# Altium project PSU24_for_FAN.PrjPcb
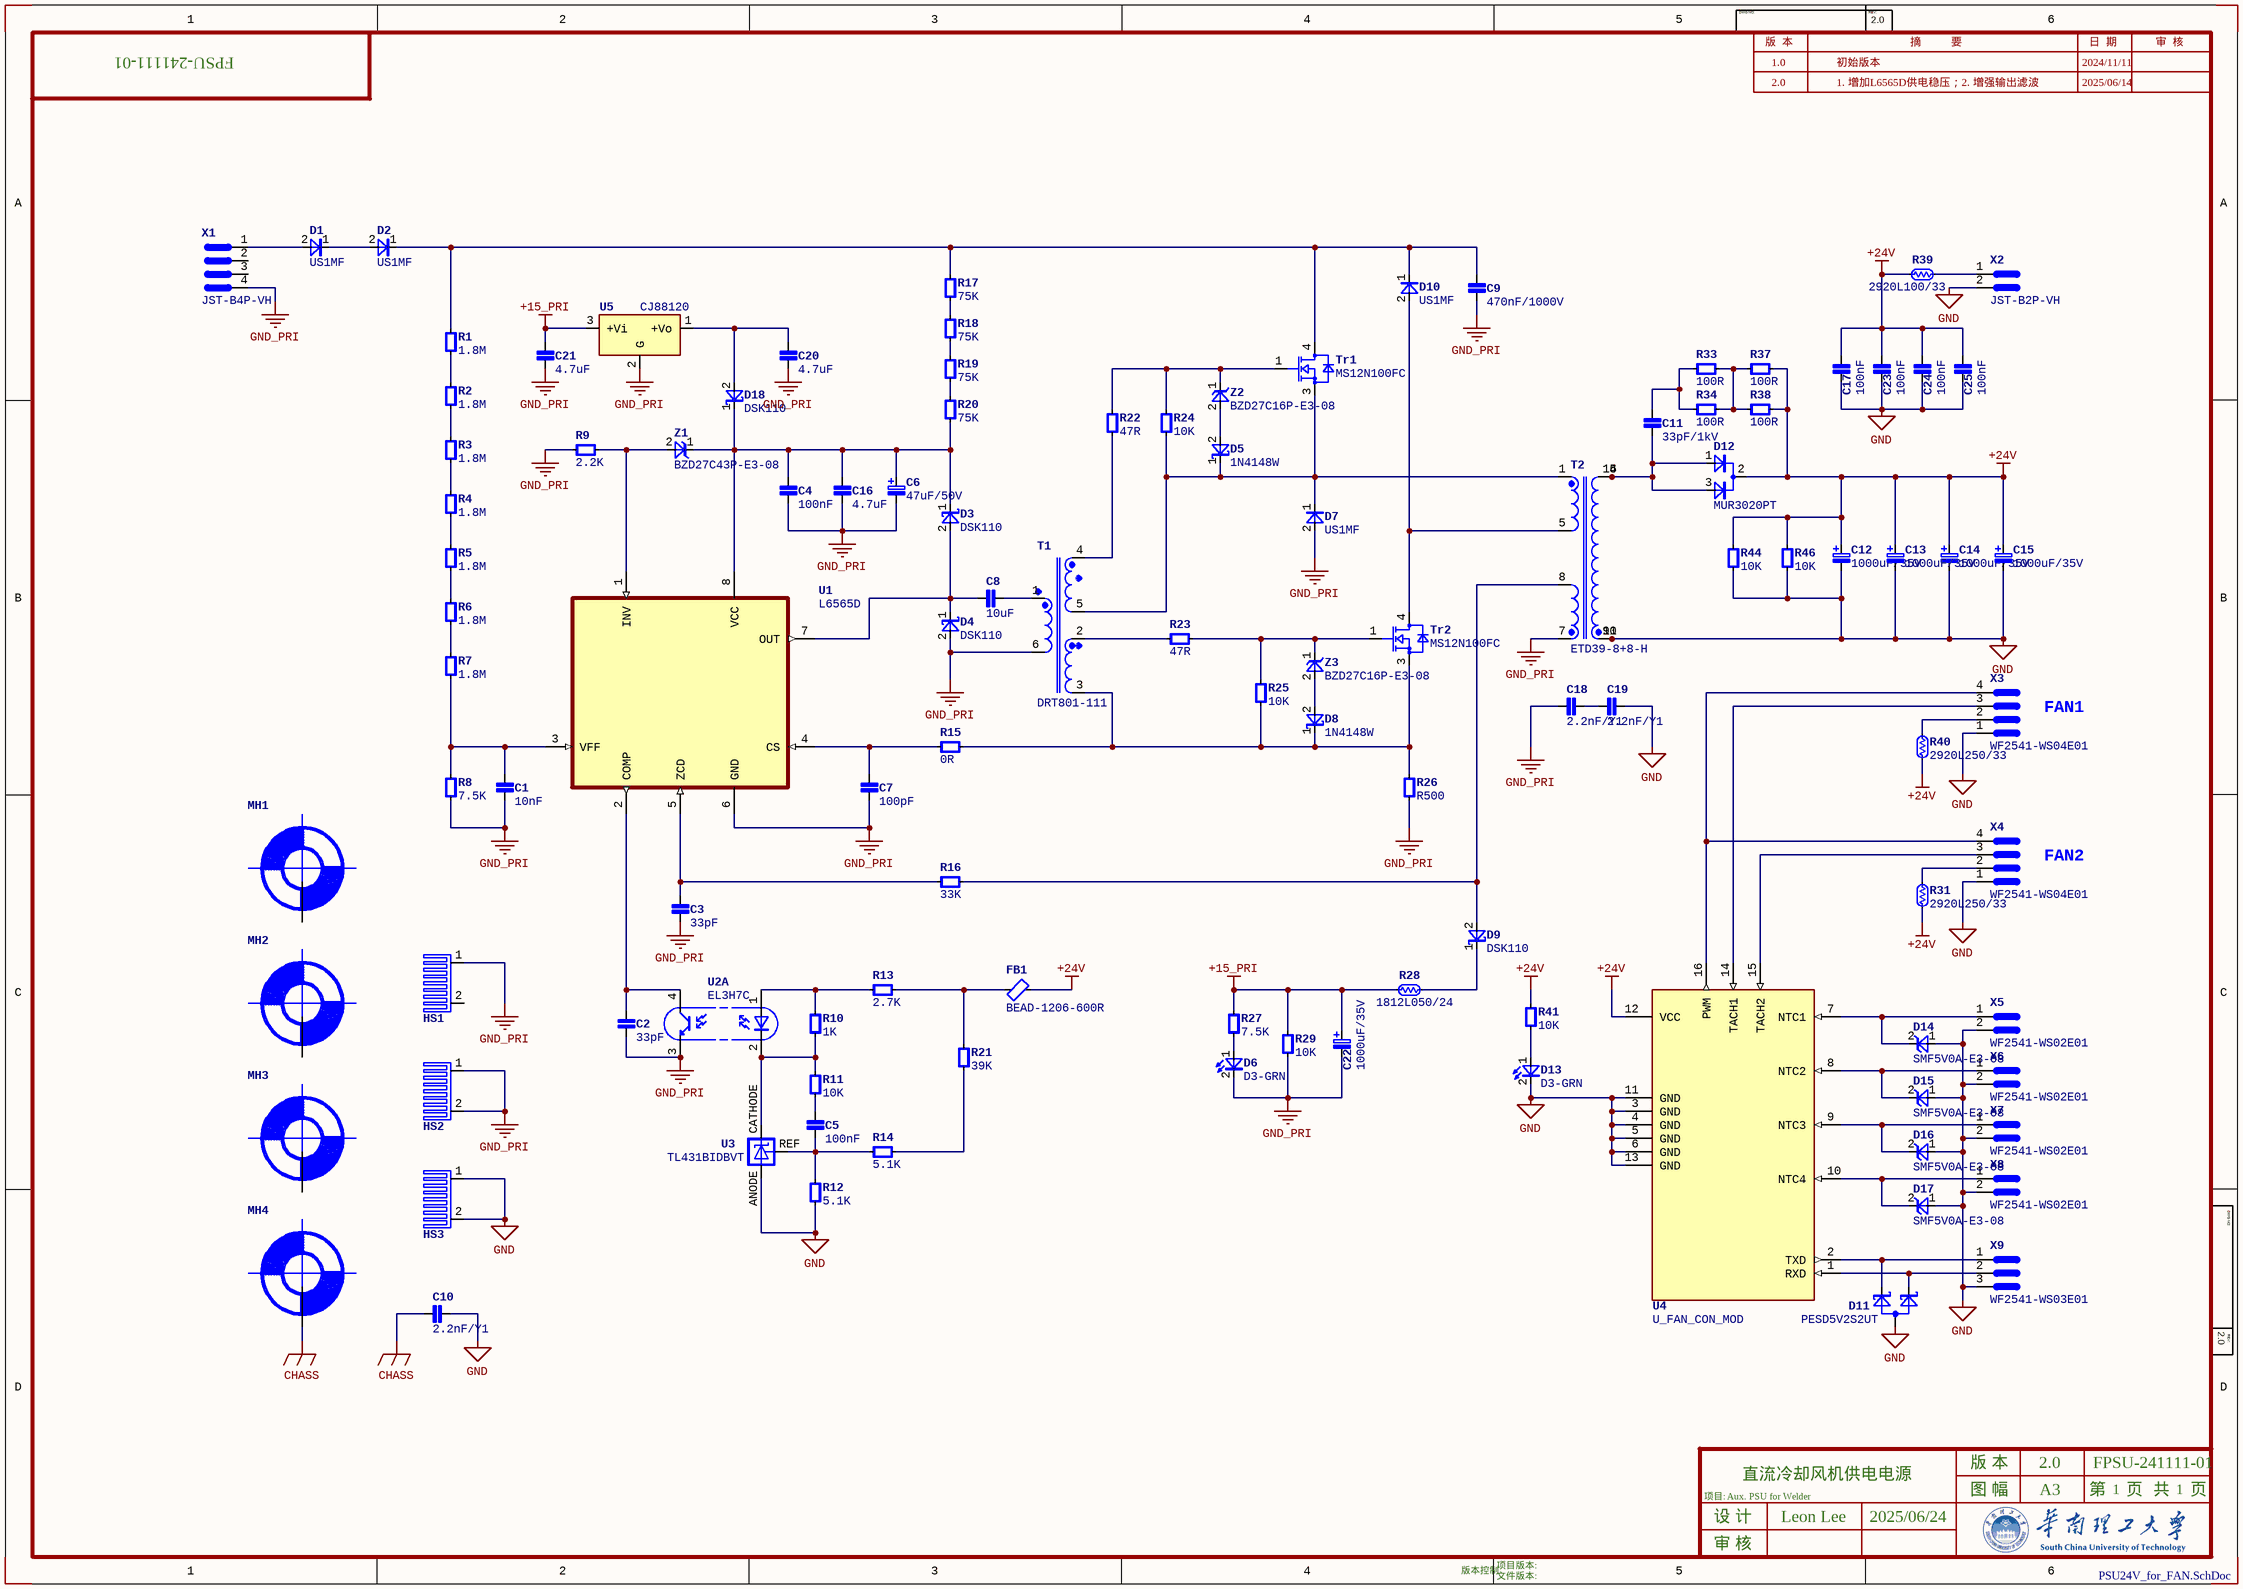
[diagram p0: PSU24V_for_FAN.SchDoc]
1 sheet, 111 parts. Net scope: global (net labels, ports and power ports of the same name join across sheets).
Board file: PSU24_for_FAN.PcbDoc

## Sheet PSU24V_for_FAN.SchDoc: 直流冷却风机供电电源
size 419 x 297 mm; Date: 2025/06/24; Author: Leon Lee; CompanyName: 华南理工大学; Organization: 华南理工大学; Address1: 五山路381号; Address2: 天河区，广州市; Address3: 广东省; DocumentNumber: FPSU-241111-01; Revision: 2.0; SheetNumber: 1; SheetTotal: 1; Project: Aux. PSU for Welder

### Parts
C1  10nF  [CAPC1206N]
C2  33pF  [CAPC1206N]
C3  33pF  [CAPC1206N]
C4  100nF  [CAPC1206N]
C5  100nF  [CAPC1206N]
C6  47uF/50V  [RB2.5M/D6.3]
C7  100pF  [CAPC1206N]
C8  10uF  [CAPC1206N]
C9  470nF/1000V  [PCM27.5-W17]
C10  2.2nF/Y1  [CAPRD10-10x5]
C11  33pF/1kV  [CAPC1206N]
C12  1000uF/35V  [RB5M/D10]
C13  1000uF/35V  [RB5M/D10]
C14  1000uF/35V  [RB5M/D10]
C15  1000uF/35V  [RB5M/D10]
C16  4.7uF  [CAPC1206N]
C17  100nF  [CAPC1206N]
C18  2.2nF/Y1  [CAPRD10-10x5]
C19  2.2nF/Y1  [CAPRD10-10x5]
C20  4.7uF  [CAPC1206N]
C21  4.7uF  [CAPC1206N]
C22  1000uF/35V  [RB5M/D10]
C23  100nF  [CAPC1206N]
C24  100nF  [CAPC1206N]
C25  100nF  [CAPC1206N]
D1  US1MF  [SMAF]
D2  US1MF  [SMAF]
D3  DSK110  [SMF-N-1K2A]
D4  DSK110  [SMF-N-1K2A]
D5  1N4148W  [SOD-123 - 1K2A]
D6  D3-GRN  [LED-D3]
D7  US1MF  [SMAF]
D8  1N4148W  [SOD-123 - 1K2A]
D9  DSK110  [SMF-N-1K2A]
D10  US1MF  [SMAF]
D11  PESD5V2S2UT  [SOT-23_N]
D12  MUR3020PT  [TO-247-3_Vertical]
D13  D3-GRN  [LED-D3]
D14  SMF5V0A-E3-08  [SMF-N]
D15  SMF5V0A-E3-08  [SMF-N]
D16  SMF5V0A-E3-08  [SMF-N]
D17  SMF5V0A-E3-08  [SMF-N]
D18  DSK110  [SMF-N-1K2A]
FB1  BEAD-1206-600R  [RESC1206N]
HS1  HS-TO247-42x25x40  [HEATSINK_TO220_Vertical_42x25x38]  (value not drawn)
HS2  HS-TO247-42x25x40  [HEATSINK_TO220_Vertical_42x25x38]  (value not drawn)
HS3  HS-TO247-42x25x40  [HEATSINK_TO220_Vertical_42x25x38]  (value not drawn)
MH1  MH1  [MH-D32-4x4]  (value not drawn)  (no BOM)
MH2  MH1  [MH-D32-4x4]  (value not drawn)  (no BOM)
MH3  MH1  [MH-D32-4x4]  (value not drawn)  (no BOM)
MH4  MH1  [MH-D32-4x4-PE]  (value not drawn)  (no BOM)
R1  1.8M  [RESC1206N]
R2  1.8M  [RESC1206N]
R3  1.8M  [RESC1206N]
R4  1.8M  [RESC1206N]
R5  1.8M  [RESC1206N]
R6  1.8M  [RESC1206N]
R7  1.8M  [RESC1206N]
R8  7.5K  [RESC1206N]
R9  2.2K  [RESC1206N]
R10  1K  [RESC1206N]
R11  10K  [RESC1206N]
R12  5.1K  [RESC1206N]
R13  2.7K  [RESC1206N]
R14  5.1K  [RESC1206N]
R15  0R  [RESC1206N]
R16  33K  [RESC1206N]
R17  75K  [RESC1206N]
R18  75K  [RESC1206N]
R19  75K  [RESC1206N]
R20  75K  [RESC1206N]
R21  39K  [RESC1206N]
R22  47R  [RESC1206N]
R23  47R  [RESC1206N]
R24  10K  [RESC1206N]
R25  10K  [RESC1206N]
R26  R500  [RESC1225N]
R27  7.5K  [RESC1206N]
R28  1812L050/24  [PTCC1812N]
R29  10K  [RESC1206N]
R31  2920L250/33  [PTC2920N]
R33  100R  [RESC1206N]
R34  100R  [RESC1206N]
R37  100R  [RESC1206N]
R38  100R  [RESC1206N]
R39  2920L100/33  [PTC2920N]
R40  2920L250/33  [PTC2920N]
R41  10K  [RESC1206N]
R44  10K  [RESC1206N]
R46  10K  [RESC1206N]
T1  DRT801-111  [TRANS-DRT801-1+1+1]
T2  ETD39-8+8-H  [ETD39-8+8pins]
Tr1  MS12N100FC  [TO-247-3_Vertical]
Tr2  MS12N100FC  [TO-247-3_Vertical]
U1  L6565D  [SOIC-8N]
U2  EL3H7C  [FP-EL3H7-G-MFG]  (parts A,B of 2)
U3  TL431BIDBVT  [SOT23-5_N]
U4  U_FAN_CON_MOD  [U_FAN_CON]
U5  CJ88120  [FP-SOT89-MFG]
X1  JST-B4P-VH  [B4P-VH]
X2  JST-B2P-VH  [B2P-VH]
X3  WF2541-WS04E01  [WF2541-WSXX01-4PIN]
X4  WF2541-WS04E01  [WF2541-WSXX01-4PIN]
X5  WF2541-WS02E01  [WF2541-WSXX01-2PIN]
X6  WF2541-WS02E01  [WF2541-WSXX01-2PIN]
X7  WF2541-WS02E01  [WF2541-WSXX01-2PIN]
X8  WF2541-WS02E01  [WF2541-WSXX01-2PIN]
X9  WF2541-WS03E01  [WF2541-WSXX01-3PIN]
Z1  BZD27C43P-E3-08  [SOD-123 - 1K2A]
Z2  BZD27C16P-E3-08  [SOD-123 - 1K2A]
Z3  BZD27C16P-E3-08  [SOD-123 - 1K2A]

### Nets
+15_PRI: C21.1 C22.1 R27.2 R28.1 R29.2 U5.3(+Vi)
+24V: C12.1 C13.1 C14.1 C15.1 C17.1 C23.1 C24.1 C25.1 D12.2(K) FB1.2 R31.1 R37.1 R38.1 R39.1 R40.1 R41.2 R44.1 R46.1 U4.12(VCC)
CHASS: C10.2 MH4.0
GND: C10.1 C12.2 C13.2 C14.2 C15.2 C17.2 C19.1 C23.2 C24.2 C25.2 D11.3(A) D13.2(K) D14.1(A) D15.1(A) D16.1(A) D17.1(A) HS3.1 HS3.2 R12.1 R44.2 R46.2 T2.9 T2.10 T2.11 U3.ANODE U4.3(GND) U4.4(GND) U4.5(GND) U4.6(GND) U4.11(GND) U4.13(GND) X2.2 X3.1 X4.1 X5.2 X6.2 X7.2 X8.2 X9.3
GND_PRI: C1.2 C2.2 C3.2 C4.2 C6.2 C7.2 C9.2 C16.2 C18.2 C20.2 C21.2 C22.2 D4.2(A) D6.2(K) D7.2(A) HS1.1 HS2.1 HS2.2 R8.2 R9.2 R26.2 R29.1 T1.6 T2.7 U1.6(GND) U2.3(E) U5.2(G) X1.4
NetC1_1: C1.1 R7.2 R8.1 U1.3(VFF)
NetC2_1: C2.1 U1.2(COMP) U2.4(C)
NetC3_1: C3.1 R16.1 U1.5(ZCD)
NetC4_1: C4.1 C6.1 C16.1 D3.1(K) D18.1(K) R20.1 U1.8(VCC) Z1.1(K)
NetC5_1: C5.1 R11.1
NetC5_2: C5.2 R12.2 R14.1 U3.REF
NetC7_1: C7.1 R15.1 U1.4(CS)
NetC8_1: C8.1 D3.2(A) D4.1(K) U1.7(OUT)
NetC8_2: C8.2 T1.1
NetC9_1: C9.1 D2.1(K) D10.1(K) R1.1 R17.2 Tr1.4(D)
NetC11_1: C11.1 R33.2 R34.2
NetC11_2: C11.2 D12.1(A) D12.3(A) T2.14 T2.15 T2.16
NetC18_1: C18.1 C19.2
NetC20_1: C20.1 D18.2(A) U5.1(+Vo)
NetD1_1: D1.1(K) D2.2(A)
NetD1_2: D1.2(A) X1.1
NetD5_1: D5.1(K) D7.1(K) R24.1 T1.5 T2.1 Tr1.3(S)
NetD5_2: D5.2(A) Z2.2(A)
NetD6_1: D6.1(A) R27.1
NetD8_1: D8.1(K) R15.2 R25.1 R26.1 T1.3 Tr2.3(S)
NetD8_2: D8.2(A) Z3.2(A)
NetD9_1: D9.1(K) R28.2
NetD9_2: D9.2(A) R16.2 T2.8
NetD10_2: D10.2(A) T2.5 Tr2.4(D)
NetD11_1: D11.1(K1) U4.2(TXD) X9.1
NetD11_2: D11.2(K2) U4.1(RXD) X9.2
NetD13_1: D13.1(A) R41.1
NetD14_2: D14.2(K) U4.7(NTC1) X5.1
NetD15_2: D15.2(K) U4.8(NTC2) X6.1
NetD16_2: D16.2(K) U4.9(NTC3) X7.1
NetD17_2: D17.2(K) U4.10(NTC4) X8.1
NetFB1_1: FB1.1 R13.2 R21.2
NetR1_2: R1.2 R2.1
NetR2_2: R2.2 R3.1
NetR3_2: R3.2 R4.1
NetR4_2: R4.2 R5.1
NetR5_2: R5.2 R6.1
NetR6_2: R6.2 R7.1
NetR9_1: R9.1 U1.1(INV) Z1.2(A)
NetR10_1: R10.1 R11.2 U2.2(K) U3.CATHODE
NetR10_2: R10.2 R13.1 U2.1(A)
NetR14_2: R14.2 R21.1
NetR17_1: R17.1 R18.2
NetR18_1: R18.1 R19.2
NetR19_1: R19.1 R20.2
NetR22_1: R22.1 T1.4
NetR22_2: R22.2 R24.2 Tr1.1(G) Z2.1(K)
NetR23_1: R23.1 R25.2 Tr2.1(G) Z3.1(K)
NetR23_2: R23.2 T1.2
NetR31_2: R31.2 X4.2
NetR33_1: R33.1 R34.1 R37.2 R38.2
NetR39_2: R39.2 X2.1
NetR40_2: R40.2 X3.2
NetU4_14: U4.14(TACH1) X3.3
NetU4_15: U4.15(TACH2) X4.3
NetU4_16: U4.16(PWM) X3.4 X4.4

Not connected (* = marked no-connect by the designer): HS1 2; MH1 0; MH2 0; MH3 0; X1 2 3

### Notes on the sheet
- 1.0
- 初始版本
- 2024/11/11
- 2.0
- 1. 增加L6565D供电稳压；2. 增强输出滤波
- 2025/06/14
- (near X3) FAN1
- (near X4) FAN2
- DWG NO:
- 版  本
- REV:
- 摘          要
- 日  期
- 审  核
- 版 本
- 项目:
- 设 计
- 审 核
- 图 幅
- A3
- 第
- 页
- 共
- 版本控制
- 项目版本:
- 文件版本:

### Library data of the parts
C1-C5 C7 C16 C17 C20 C21 C23-C25 = CAPACITOR(S): 名称: 贴片电容; 代号: C; 型号: X7R-50V-1206-10%; 备注: X7R/X5R系列
C6 = CAPACITOR POL(S): 名称: 电解电容; 代号: C; 型号: RUBYCON-YK; 备注: Ø6.3x12mm，脚距2.5mm
C8 = CAPACITOR(S): 名称: 贴片电容; 代号: C; 型号: X7R-25V-1206-10%; 备注: X7R/X5R系列
C9 = CAPACITOR(S): 名称: 金属化聚丙烯薄膜电容; 代号: C; 型号: CBB-1000V-10%; 备注: 脚距27.5mm，厚17mm
C10 C18 C19 = CAPACITOR(S): 名称: 交流陶瓷安规电容; 代号: C; 型号: Y1-400Vac-10%; 备注: 10mm脚距
C11 = CAPACITOR(S): 名称: 贴片电容; 代号: C; 型号: CC1206JKNPOCBN330; 备注: NPO系列，1kV，5%
C12-C15 C22 = CAPACITOR POL(S): 名称: 电解电容; 代号: C; 型号: RUBYCON-YK; 备注: Ø10x20mm，脚距5mm
D1 D2 D7 D10 = DIODE(S): 二极管; 代号: D; 名称: 贴片二极管; 型号: 1A/1000V/快恢复; 备注: SMAF封装
D3 D4 D9 D18 = DIODE SCHOTTKY(S): 肖特基二极管; 名称: 贴片肖特基二极管; 代号: D; 型号: 1A/100A/SMF; 备注: SMF或SOD-123FL封装
D5 D8 = DIODE SCHOTTKY(S): 肖特基二极管; 名称: 贴片二极管; 代号: D; 型号: 1N4148W/SOD123; 备注: SOD-123封装
D6 D13 = LED(S): 发光二极管; pin to pad: 1>A 2>K; 代号: DLED; 型号: Ø3-绿色; 备注: 雾状透镜; 名称: 发光二极管
D11 = DIODE BAS40-06: Schottky barrier (double) diodes; 名称: 贴片ESD二极管; 代号: DESD; 型号: 5V，双路，单向; 备注: SOT23封装，单向TVS
D12 = DIODE MUR1620CT: 快恢复二极管; 代号: D; 型号: 200V/30A/TO-247; 备注: TO-247，共阴极; 名称: 快恢复二极管
D14-D17 = DIODE ZENER(S): 齐纳二极管; 名称: 贴片ESD二极管; 代号: DESD; 型号: SMF-5V-单向; 备注: Vishay, SMF-TVS
FB1 = FerriteBead1: 磁珠电感; 代号: LB; 名称: 贴片磁珠电感; 型号: BEAD-1206-600R
HS1-HS3 = HEATSINK_2PINS: 散热器, 2脚; 代号: HS; 名称: 铝散热器; 备注: 表面发黑; 型号: TO247-42x25x40
MH1-MH4 = MH1: 安装孔
R1-R9 R15-R20 R22-R26 R33 R34 R37 R38 R44 R46 = RESISTOR(S): 电阻; 代号: R; 名称: 贴片电阻; 型号: CR1206-1%; 备注: 风华或国巨
R10-R14 R21 R27 R29 R41 = RESISTOR(S): 名称: 贴片电阻; 代号: R; 型号: CR1206-1%; 备注: 风华或国巨
R28 = RESISTOR(S) NL: None Liner Resistor; 代号: RT; 名称: 贴片可恢复保险; 型号: 0.5A/24V/1812
R31 R40 = RESISTOR(S) NL: None Liner Resistor; 代号: RT; 名称: 贴片可恢复保险; 型号: 2.5A/33V/2920
R39 = RESISTOR(S) NL: None Liner Resistor; 代号: RT; 名称: 贴片可恢复保险; 型号: 1A/33V/2920
T1 = Transformer DRT801-111: IGBT驱动变压器, DRT801/111, 12.5x16.6mm; 代号: T; 名称: 脉冲变压器; 型号: DRT801-1111; 备注: 北京耀华德昌
T2 = TRANSFORM-Flyback_PSU_for_FAN: 反激变压器，初级2组，次级2组，通用焊接电源风扇供电，24V+24V; 代号: T; 名称: 变压器; 型号: ETD39-8+8卧式; 备注: 按图纸加工
Tr1 Tr2 = MOSFET - N-CH: MOSFET N-CH D-PAK/TO252; pin to pad: 4>2; Manufacturer: Fairchild; Part Number: SUD40N08-16-E3; 代号: Tr; 名称: 场效应管; 型号: 1000V/12A/TO-247
U1 = L6565D: ST, QUASI-RESONANT SMPS CONTROLLER; 代号: U; 名称: 贴片集成电路; 型号: L6565D; 备注: ST
U2 = Optical-Couple: 代号: IC; 名称: 贴片集成电路; 备注: Everlight(亿光); 型号: EL3H7C
U3 = TL431CLP: 可调基准电压集成; pin to pad: ANODE>5 CATHODE>3 REF>4; 代号: IC; 名称: 贴片集成电路; 备注: SOT23-5封装; 型号: TL431BIDBVT
U4 = U_FAN_CON_MOD: 直流风扇转速控制模块; 代号: U; 名称: 专用厚膜集成电路; 备注: 定制
U5 = 78LXX: pin to pad: 1>3 2>1 3>2; 代号: U; 名称: 贴片集成电路; 备注: SOT89封装，12V@150mA; 型号: CJ88120
X1 = 4PIN-PCB-Connector: 线路板接插件; 代号: X; 名称: 接插件; 备注: JST; 型号: B4P-VH
X2 = 2PIN-PCB-Connector: 线路板接插件; 代号: X; 名称: 接插件; 备注: JST; 型号: B2P-VH
X3 X4 = 4PIN-PCB-Connector: 线路板接插件; 代号: X; 名称: 接插件; 备注: 2.54间距，4pin; 型号: WF2541-WS04E01
X5-X8 = 2PIN-PCB-Connector: 线路板接插件; 代号: X; 名称: 接插件; 备注: 2.54间距，2pin; 型号: WF2541-WS02E01
X9 = 3PIN-PCB-Connector: 线路板接插件; 代号: X; 名称: 接插件; 备注: 2.54间距，3pin; 型号: WF2541-WS03E01
Z1 = DIODE ZENER(S): 齐纳二极管; 名称: 贴片稳压二极管; 代号: DZ; 型号: 43V/0.5W/SOD123; 备注: SOD-123封装
Z2 Z3 = DIODE ZENER(S): 齐纳二极管; 名称: 贴片稳压二极管; 代号: DZ; 型号: 16V/0.5W/SOD123; 备注: SOD-123封装